# Altium schematic sheet MCU.SchDoc
size A4
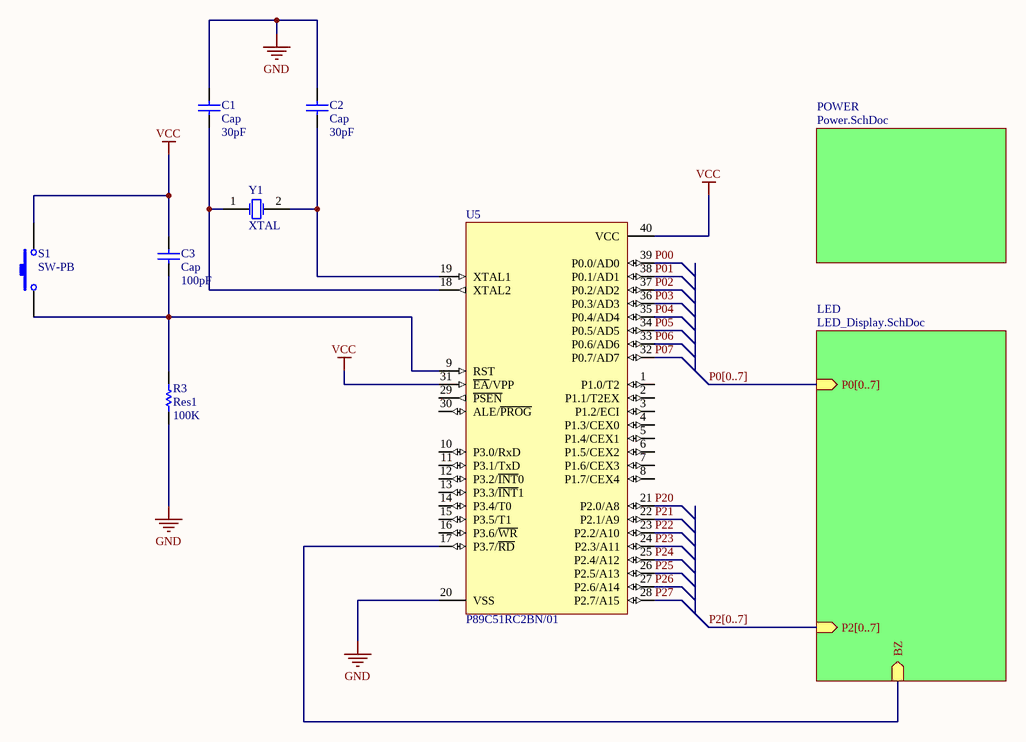
[diagram p0: MCU.SchDoc]

## Parts
C1  Cap  value 30pF  [RAD-0.3]
C2  Cap  value 30pF  [RAD-0.3]
C3  Cap  value 100pF  [RAD-0.3]
R3  Res1  value 100K  [AXIAL-0.3]
S1  SW-PB  [SPST-2]
U5  P89C51RC2BN/01  [SOT129-1]
Y1  XTAL  [R38]

## Sub-sheets
LED = LED_Display.SchDoc: P0[0..7] (in), P2[0..7] (in), BZ (in)
POWER = Power.SchDoc: no entries

## Nets
GND: C1.2 C2.2 R3.1 U5.20(VSS)
VCC: C3.2 S1.2 U5.31(~{EA}/VPP) U5.40(VCC)
P00: U5.39(P0.0/AD0)
P01: U5.38(P0.1/AD1)
P02: U5.37(P0.2/AD2)
P03: U5.36(P0.3/AD3)
P04: U5.35(P0.4/AD4)
P05: U5.34(P0.5/AD5)
P06: U5.33(P0.6/AD6)
P07: U5.32(P0.7/AD7)
P20: U5.21(P2.0/A8)
P21: U5.22(P2.1/A9)
P22: U5.23(P2.2/A10)
P23: U5.24(P2.3/A11)
P24: U5.25(P2.4/A12)
P25: U5.26(P2.5/A13)
P26: U5.27(P2.6/A14)
P27: U5.28(P2.7/A15)
NetC1_1: C1.1 U5.18(XTAL2) Y1.1(OSC1)
NetC2_1: C2.1 U5.19(XTAL1) Y1.2(OSC2)
NetC3_1: C3.1 R3.2 S1.1 U5.9(RST)
NetU5_17: U5.17(P3.7/~{RD}) ; sheet LED/BZ

Not connected (* = marked no-connect by the designer): U5 1(P1.0/T2) 2(P1.1/T2EX) 3(P1.2/ECI) 4(P1.3/CEX0) 5(P1.4/CEX1) 6(P1.5/CEX2) 7(P1.6/CEX3) 8(P1.7/CEX4) 10(P3.0/RxD) 11(P3.1/TxD) 12(P3.2/~{INT}0) 13(P3.3/~{INT}1) 14(P3.4/T0) 15(P3.5/T1) 16(P3.6/~{WR}) 29(~{PSEN}) 30(ALE/~{PROG})

## Buses and harness runs
bus P0[0..7] = sheet LED/P0[0..7]
bus P2[0..7] = sheet LED/P2[0..7]

## Library data of the parts
C1-C3 = Cap: Capacitor; Published: 8-Jun-2000; LatestRevisionDate: 17-Jul-2002; LatestRevisionNote: Re-released for DXP Platform.; PackageReference: RAD-0.3; Publisher: Altium Limited; PackageDescription: Radial Cap, Thru-Hole; 2 Leads; 0.3 in Pin Spacing
R3 = Res1: Resistor; Published: 8-Jun-2000; LatestRevisionDate: 17-Jul-2002; LatestRevisionNote: Re-released for DXP Platform.; PackageReference: AXIAL-0.3; Publisher: Altium Limited; PackageDescription: Axial Device, Thru-Hole; 2 Leads; 0.3 in Pin Spacing
S1 = SW-PB: Switch; Published: 24-Mar-1999; LatestRevisionDate: 17-Jul-2002; LatestRevisionNote: Re-released for DXP Platform.; PackageReference: SPST-2; Publisher: Altium Limited; PackageDescription: Switch; 2 Leads
U5 = P89C51RC2BN/01: 80C51 8-Bit Flash Microcontroller Family, 32 kB ISP/IAP Flash with 512 B RAM.; Published: 21-May-2003; DatasheetVersion: 18-Jul-2002; PackageVersion: Aug-2000; PackageReference: SOT129-1; Publisher: Altium Limited; PackageDescription: DIP, Plastic; 40 Leads; Row Spacing 15.24 mm; Pitch 2.54 mm; Code_JEDEC: MO-015; ComponentLink1Description: Manufacturer Link; ComponentLink1URL: http://www-us2.semiconductors.philips.com/; ComponentLink2Description: Datasheet; ComponentLink2URL: http://www.semiconductors.philips.com/acrobat/datasheets/P89C51RA2_RB2_RC2_RD2_2.pdf
Y1 = XTAL: Crystal Oscillator; Published: 8-Jun-2000; LatestRevisionDate: 17-Jul-2002; LatestRevisionNote: Re-released for DXP Platform.; PackageReference: R38; Publisher: Altium Limited; PackageDescription: Crystal, Thru-Hole; 2 Leads; Body 3.1 x 8.2 mm (Dia.xH)